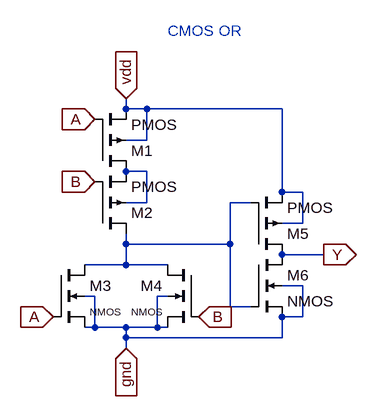
[diagram p0: schematic or.asc]
or.asc, the LTspice schematic file:
Version 4
SHEET 1 880 680
WIRE 208 16 208 0
WIRE 240 16 208 16
WIRE 448 16 240 16
WIRE 240 64 240 16
WIRE 240 64 208 64
WIRE 240 112 208 112
WIRE 448 144 448 16
WIRE 480 144 448 144
WIRE 240 160 240 112
WIRE 240 160 208 160
WIRE 400 160 368 160
WIRE 480 192 480 144
WIRE 480 192 448 192
WIRE 208 224 208 208
WIRE 368 224 368 160
WIRE 368 224 208 224
WIRE 512 240 448 240
WIRE 208 256 208 224
WIRE 208 256 144 256
WIRE 272 256 208 256
WIRE 480 288 448 288
WIRE 160 304 144 304
WIRE 272 304 256 304
WIRE 368 320 368 224
WIRE 400 320 368 320
WIRE 480 336 480 288
WIRE 480 336 448 336
WIRE 160 352 160 304
WIRE 160 352 144 352
WIRE 208 352 160 352
WIRE 256 352 256 304
WIRE 256 352 208 352
WIRE 272 352 256 352
WIRE 208 368 208 352
WIRE 448 368 448 336
WIRE 448 368 208 368
WIRE 208 384 208 368
FLAG 208 0 vdd
IOPIN 208 0 In
FLAG 160 32 A
IOPIN 160 32 In
FLAG 96 336 A
IOPIN 96 336 In
FLAG 320 336 B
IOPIN 320 336 In
FLAG 160 128 B
IOPIN 160 128 In
FLAG 208 384 gnd
IOPIN 208 384 In
FLAG 512 240 Y
IOPIN 512 240 Out
SYMBOL pmos4 160 112 M180
SYMATTR InstName M1
SYMBOL pmos4 160 208 M180
SYMATTR InstName M2
SYMBOL nmos4 96 256 R0
WINDOW 3 56 72 Left 1
SYMATTR InstName M3
SYMBOL nmos4 320 256 M0
WINDOW 3 56 72 Left 1
SYMATTR InstName M4
SYMBOL pmos4 400 240 M180
SYMATTR InstName M5
SYMBOL nmos4 400 240 R0
SYMATTR InstName M6
TEXT 272 -104 Left 2 ;CMOS OR

The netlist it stands for:
* or.asc
M1 N001 A vdd vdd PMOS
M2 N002 B N001 N001 PMOS
M3 N002 A gnd gnd NMOS
M4 N002 B gnd gnd NMOS
M5 Y N002 vdd vdd PMOS
M6 Y N002 gnd gnd NMOS
.model NMOS NMOS
.model PMOS PMOS
.lib standard.mos
* CMOS OR
.backanno
.end